# EAGLE schematic design1 (EAGLE 9.5.1)
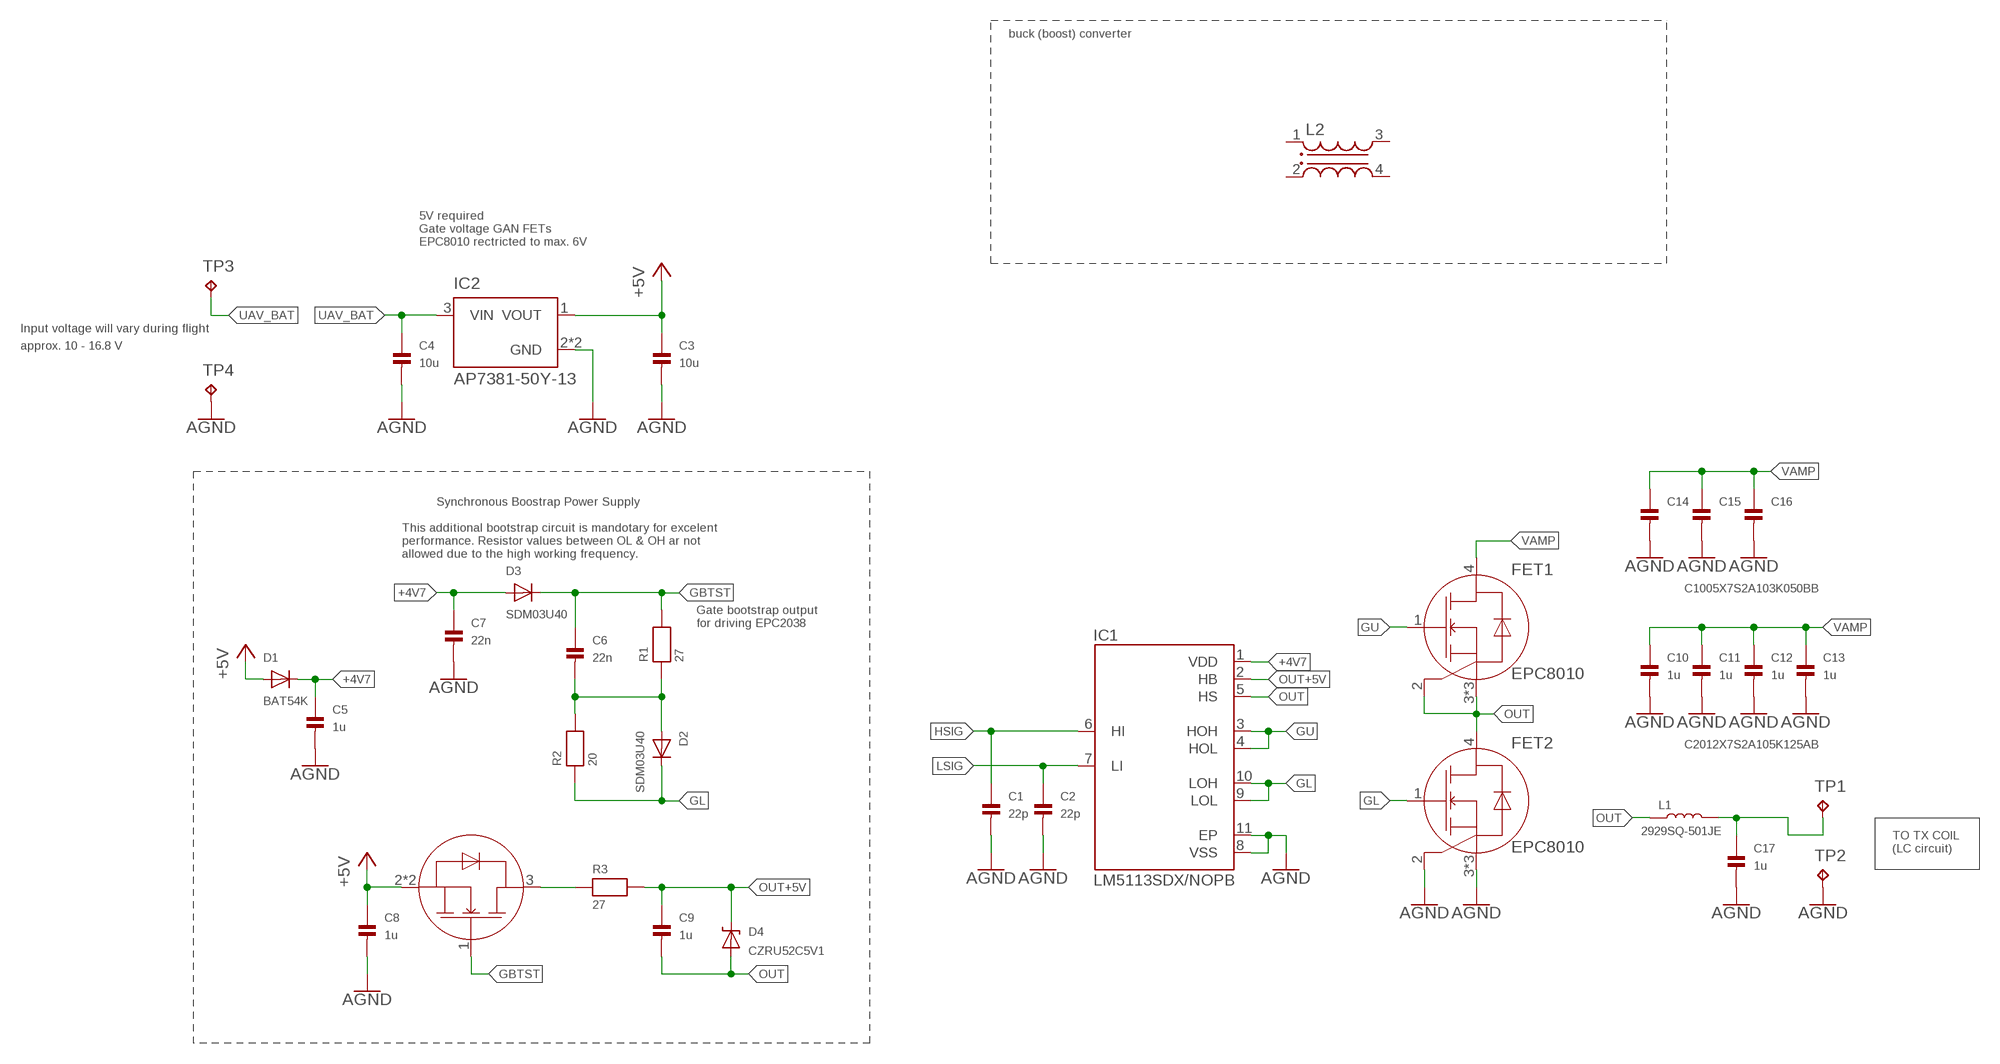
[diagram p0: schematic, sheet 1]

## Parts
C1  22p  CAP_CERAMIC0603  [0603]
C2  22p  CAP_CERAMIC0603  [0603]
C3  10u  CAP_CERAMIC0603  [0603]
C4  10u  CAP_CERAMIC0603  [0603]
C5  1u  CAP_CERAMIC0603  [0603]
C6  22n  CAP_CERAMIC0603  [0603]
C7  22n  CAP_CERAMIC0603  [0603]
C8  1u  CAP_CERAMIC0603  [0603]
C9  1u  CAP_CERAMIC0603  [0603]
C10  1u  CAP_CERAMIC0805  [0805]
C11  1u  CAP_CERAMIC0805  [0805]
C12  1u  CAP_CERAMIC0805  [0805]
C13  1u  CAP_CERAMIC0805  [0805]
C14  CAP_CERAMIC0402  [0402]
C15  CAP_CERAMIC0402  [0402]
C16  CAP_CERAMIC0402  [0402]
C17  1u  CAP_CERAMIC0805  [0805]
D1  BAT54K  DIODESOD-523  [SOD-523]
D2  SDM03U40  DIODESOD-523  [SOD-523]
D3  SDM03U40  DIODESOD-523  [SOD-523]
D4  CZRU52C5V1  CZRU52  [SOD-523F]
FET1  EPC8010  [BGA-8010]
FET2  EPC8010  [BGA-8010]
FET3  EPC2038  [BGA-2038]
IC1  LM5113SDX/NOPB  [SON80P400X400X80-11N]
IC2  AP7381-50Y-13  [FOOT_XC6201P332PR-G]
L1  2929SQ-501JE  2929SQ-501  [2929SQ-501]
L2  WE-DD_1260_CROSSED_744871100  [WE-DD_1210/1260/1280_CROSSED]
R1  27  RESISTOR0603  [0603]
R2  20  RESISTOR0603  [0603]
R3  27  RESISTOR0603  [0603]
TP1  TPTP20SQ  [TP20SQ]
TP2  TPTP20SQ  [TP20SQ]
TP3  TPTP20SQ  [TP20SQ]
TP4  TPTP20SQ  [TP20SQ]

## Nets
+4V7: C5.1 C7.1 D1.K(C) D3.A IC1.1(VDD)
+5V: C3.1 C8.1 D1.A FET3.2(SOURCE) FET3.4(SOURCE) IC2.1(VOUT)
AGND: C1.2 C2.2 C3.2 C4.2 C5.2 C7.2 C8.2 C10.2 C11.2 C12.2 C13.2 C14.2 C15.2 C16.2 C17.2 FET2.2(SOURCE-RETURN) IC1.8(VSS) IC1.11(EP) IC2.2(GND) IC2.2.1(GND) TP2.TP TP4.TP
GBTST: C6.1 D3.K(C) FET3.1(GATE) R1.2
GL: D2.K(C) FET2.1(GATE) IC1.9(LOL) IC1.10(LOH) R2.1
GU: FET1.1(GATE) IC1.3(HOH) IC1.4(HOL)
HSIG: C1.1 IC1.6(HI)
LSIG: C2.1 IC1.7(LI)
N$1: FET3.3(DRAIN) R3.1
N$6: FET2.3(SOURCE) FET2.5(SOURCE) FET2.6(SOURCE) ; supply symbol labelled AGND
N$7: C6.2 D2.A R1.1 R2.2
N$8: C17.1 L1.2 TP1.TP
OUT: C9.2 D4.2(A) FET1.2(SOURCE-RETURN) FET1.3(SOURCE) FET1.5(SOURCE) FET1.6(SOURCE) FET2.4(DRAIN) IC1.5(HS) L1.1
OUT+5V: C9.1 D4.1(C) IC1.2(HB) R3.2
UAV_BAT: C4.1 IC2.3(VIN) TP3.TP
VAMP: C10.1 C11.1 C12.1 C13.1 C14.1 C15.1 C16.1 FET1.4(DRAIN)
Unconnected: L2.1 L2.2 L2.3 L2.4

## Notes on the sheet
- buck (boost) converter
- 5V required
  Gate voltage GAN FETs
  EPC8010 rectricted to max. 6V
- Input voltage will vary during flight
- approx. 10 - 16.8 V
- Synchronous Boostrap Power Supply
- This additional bootstrap circuit is mandotary for excelent
  performance. Resistor values between OL & OH ar not 
  allowed due to the high working frequency.
- C1005X7S2A103K050BB
- Gate bootstrap output 
  for driving EPC2038
- C2012X7S2A105K125AB
- TO TX COIL
  (LC circuit)

## Library data of the parts
C1-C17 = microbuilder:CAP_CERAMIC: Ceramic Capacitors 0402 - 0402 Surface Mount Capacitors 16pF 50V 5% [Digikey: 445-4899-2-ND] 18pF 50V 5% [Digikey: 490-1281-2-ND] 22pF 50V 5% [Digikey: 490-1283-2-ND] 68pF 50V 5% [Digikey: 490-1289-2-ND] 0.1uF 10V 10% [Digikey: 490-1318-2-ND] 1.0uF 6.3V 10% [Digikey: 490-1320-2-ND] 0603 - 0603 Surface Mount Capacitors 16 pF 50V 5% [Digikey: 445-5051-2-ND] 22 pF 50V [Digikey: PCC220ACVTR-ND] 33 pF 50V 5% [Digikey: 490-1415-1-ND] 56pF 50V 5% [Digikey: 490-1421-1-ND] 220pF 50V 5% [Digikey: 445-1285-1-ND] 680 pF 50V 2200 pF 50V 5% C0G [Digikey: 445-1297-1-ND] 5600 pF 100V 5% X7R [Digikey: 478-3711-1-ND] 0.1 µF 25V 10% [Digikey: PCC2277TR-ND] 0.22 µF 16V 10% X7R [Digikey: 445-1318-1-ND] 1.0 µF 25V 10% [Digikey: 445-5146-2-ND] 0603 - RF Specific 3pF 250V +/-0.1pF RF [Digikey: 712-1347-1-ND] 18 pF 250V 5% [Digikey: 478-3505-1-ND or 712-1322-1-ND] 56 pF 250V 5% C0G RF [Digikey: 490-4867-1-ND] 68 pF 250V RF [Digikey: 490-4868-1-ND] 0805 - 0805 Surface Mount Capacitors 220 pF 250V 2% RF Ceramic Capacitor [Digikey: 712-1398-1-ND] 1000 pF 50V 2% NP0 Ceramic Capacitor [Digikey: 478-3760-1-ND] 0.1 µF 25V 10% Ceramic Capacitor [Digikey: PCC1828TR-ND] 1.0 µF 16V 10% Ceramic Capacitor[Digikey: 490-1691-2-ND] 10.0 µF 10V 10% Ceramic Capacitor[Digikey: 709-1228-1-ND] 10.0 uF 16V 10% Ceramic Capacitor [Digikey: 478-5165-2-ND] 47 uF 6.3V 20% Ceramic Capacitor [Digikey: 587-1779-1-ND or 399-5506-1-ND] 1206 - 1206 Surface Mount Capacitors 47uF 10V 20% Ceramic Capacitor [Digikey: 490-5528-1-ND or 399-5508-1-ND or 445-6010-1-ND] 100uF 6.3V -20%, +80% Y5V Ceramic Capacitor (Digikey: 490-4512-1-ND, Mouser: 81-GRM31CF50J107ZE1L)
D1-D3 = microbuilder:DIODE: Diode SMA Model Volts Amps Type Vf Vr Digikey # Notes SSA34-E3 40V 3A Schottky 480mV @ 3A 200uA @ 40V SSA34-E3/61TGITR-ND CDBA120-G 20V 1A Schottky 500mV @ 1A 500uA @ 20V 641-1014-6-ND REEL MBRA210 10V 2A Schottky 350mV @ 2A 700uA @ 10V MBRA210LT3 SOD-123 Model Volts Amps Type Vf Vr Order # Notes BAT54T1G 30V 200mA Schottky 800mV @ 200mA 2uA @ 25V BAT54T1GOSTR-ND B0530W 30V 500mA Schottky 430mV @ 500mA 130uA @ 30V B0530W-FDICT-ND REEL MBR120 1A 20V Schottky 340mV @ 1A MBR120VLSFT1GOSCT-ND SOD-323 Model Volts Amps Type Vf Vr Order # Notes PMEG2005EJ 20V 500mA Schottky 355mV @ 500mA 568-4110-1-ND ZLLS410 10V 570mA Schottky 380mV @ 570mA ZLLS410CT-ND 1N4148WS 75V 150mA Silicon/Simple 1V 1N4148WSFSCT-ND REEL SOD-523 Model Volts Amps Type Vf Vr Order # Notes BAT54XV2 30V 200mA Schottky 0.8V @ 100mA BAT54XV2CT-ND TB751S 30V 30mA Schottky RB751S-40TE61CT-ND SOT23-R/W (R = Solder Paste/Reflow Ovens, W = Hand-Soldering) Model Volts Amps Type Vf Vr Order # Notes BAT54FILM 40V 300mA Schottky 497-7162-1-ND
D4 = microbuilder:CZRU52
FET1 FET2 = EPC-MOS:EPC8010
FET3 = EPC-MOS:EPC2038
IC1 = LM5113SDX_NOPB:LM5113SDX/NOPB: 5A, 100V Half-Bridge Gate Driver for Enhancement Mode GaN FETs 10-WSON -40 to 125 Check availability <https://pricing.snapeda.com/parts/LM5113SDX/NOPB/Texas%20Instruments/view-part?ref=eda>; AVAILABILITY: In Stock; DESCRIPTION: 1.2-A/5-A, 100-V half bridge gate driver for GaNFET 10-WSON -40 to 125; MF: Texas Instruments; MP: LM5113SDX/NOPB; PACKAGE: WSON-10 Texas Instruments; PRICE: None; PURCHASE-URL: https://pricing.snapeda.com/search?q=LM5113SDX/NOPB&ref=eda
IC2 = AP7381:AP7381-50Y-13: 250mA CMOS LDO, Isupply 1uA and 2% Vout Accuracy 3 SOT-89 T/R; AVAILABILITY: Unavailable; DESCRIPTION: 250mA CMOS LDO, Isupply 1uA and 2% Vout Accuracy 3 SOT-89 T/R; MF: Microchip; MP: MCP1700T-3602E/MB; PACKAGE: SOT-89 Microchip; PRICE: None
L1 = 2929SQ:2929SQ-501
L2 = PowerMagnetics (rev18e):WE-DD_1260_CROSSED: WE-DD SMD Shielded Coupled Inductor Characteristics 1:1 transformer Double inductor with two identical windings 4 different sizes available Operating temperature: –40 ºC to +125 ºC Recommended solder profile: Reflow Custom designs on request Applications For SEPIC and CUK topologies Flyback applications Switching regulators with second, unregulated output voltages <http://katalog.we-online.de/media/images/v2/Family_WE-DD.jpg> Details see: http://katalog.we-online.de/en/pbs/WE-DD Updated by Dan Xu 2014-06-10 2014 (C) Wurth Elektronik; WE-NUMBER: 744871100/10uH
R1-R3 = microbuilder:RESISTOR: Resistors 0402 - 0402 Surface Mount Package 22 Ohm 1% 1/16W [Digikey: 311-22.0LRTR-ND] 33 Ohm 5% 1/16W 1.0K 5% 1/16W 1.5K 5% 1/16W 2.0K 1% 1/16W 10.0K 1% 1/16W [Digikey: 311-10.0KLRTR-ND] 10.0K 5% 1/16W [Digikey: RMCF0402JT10K0TR-ND] 12.1K 1% 1/16W [Digikey: 311-22.0LRTR-ND] 100.0K 5% 1/16W 0603 - 0603 Surface Mount Package 0 Ohm 1/10 Watt 1% Resistor 15 Ohm 1/10 Watt 1% Resistor 33 Ohm 1/10 Watt 1% Resistor 49.9 Ohm 1/10 Watt 1% Resistor 100 Ohm 1/10 Watt 1% Resistor 150 Ohm 1/10 Watt 1% Resistor 240 Ohm 1/10 Watt 1% Resistor 390 Ohm 1/10 Watt 1% Resistor 560 Ohm 1/10 Watt 1% Resistor 680 Ohm 1/10 Watt 1% Resistor 750 Ohm 1/10 Watt 1% Resistor 1.0K Ohm 1/10 Watt 1% Resistor 1.5K Ohm 1/10 Watt 1% Resistor 2.0K Ohm 1/10 Watt 1% Resistor 2.2K Ohm 1/10 Watt 1% Resistor 3.3K Ohm 1/10 Watt 1% Resistor 4.7K Ohm 1/10 Watt 1% Resistor 10.0K Ohm 1/10 Watt 1% Resistor 12.0K Ohm 1/10 Watt 1% Resistor 12.1K Ohm 1/10 Watt 1% Resistor 20.0K Ohm 1/10 Watt 1% Resistor 33.0K Ohm 1/10 Watt 1% Resistor 100.0K Ohm 1/10 Watt 1% Resistor 0805 - 0805 Surface Mount Package 0 Ohm 1/8 Watt 1% Resistor 33 Ohm 1/8 Watt 1% Resistor 100 Ohm 1/8 Watt 1% Resistor 150 Ohm 1/8 Watt 1% Resistor 200 Ohm 1/8 Watt 1% Resistor 240 Ohm 1/8 Watt 1% Resistor 330 Ohm 1/8 Watt 1% Resistor 390 Ohm 1/8 Watt 1% Resistor 470 Ohm 1/8 Watt 1% Resistor 1.0K Ohm 1/8 Watt 1% Resistor 1.5K Ohm 1/8 Watt 1% Resistor 2.0K Ohm 1/8 Watt 1% Resistor 4.7K Ohm 1/8 Watt 1% Resistor 5.1K Ohm 1/8 Watt 1% Resistor 5.6K Ohm 1/8 Watt 1% Resistor 10.0K Ohm 1/8 Watt 1% Resistor 22.0K Ohm 1/8 Watt 1% Resistor 33.0K Ohm 1/8 Watt 1% Resistor 100K Ohm 1/8 Watt 1% Resistor 1206 - 1206 Surface Mount Package 2012 - 2010 Surface Mount Package 0.11 Ohm 1/2 Watt 1% Resistor - Digikey: RHM.11UCT-ND
TP1-TP4 = testpad:TP: Test pad